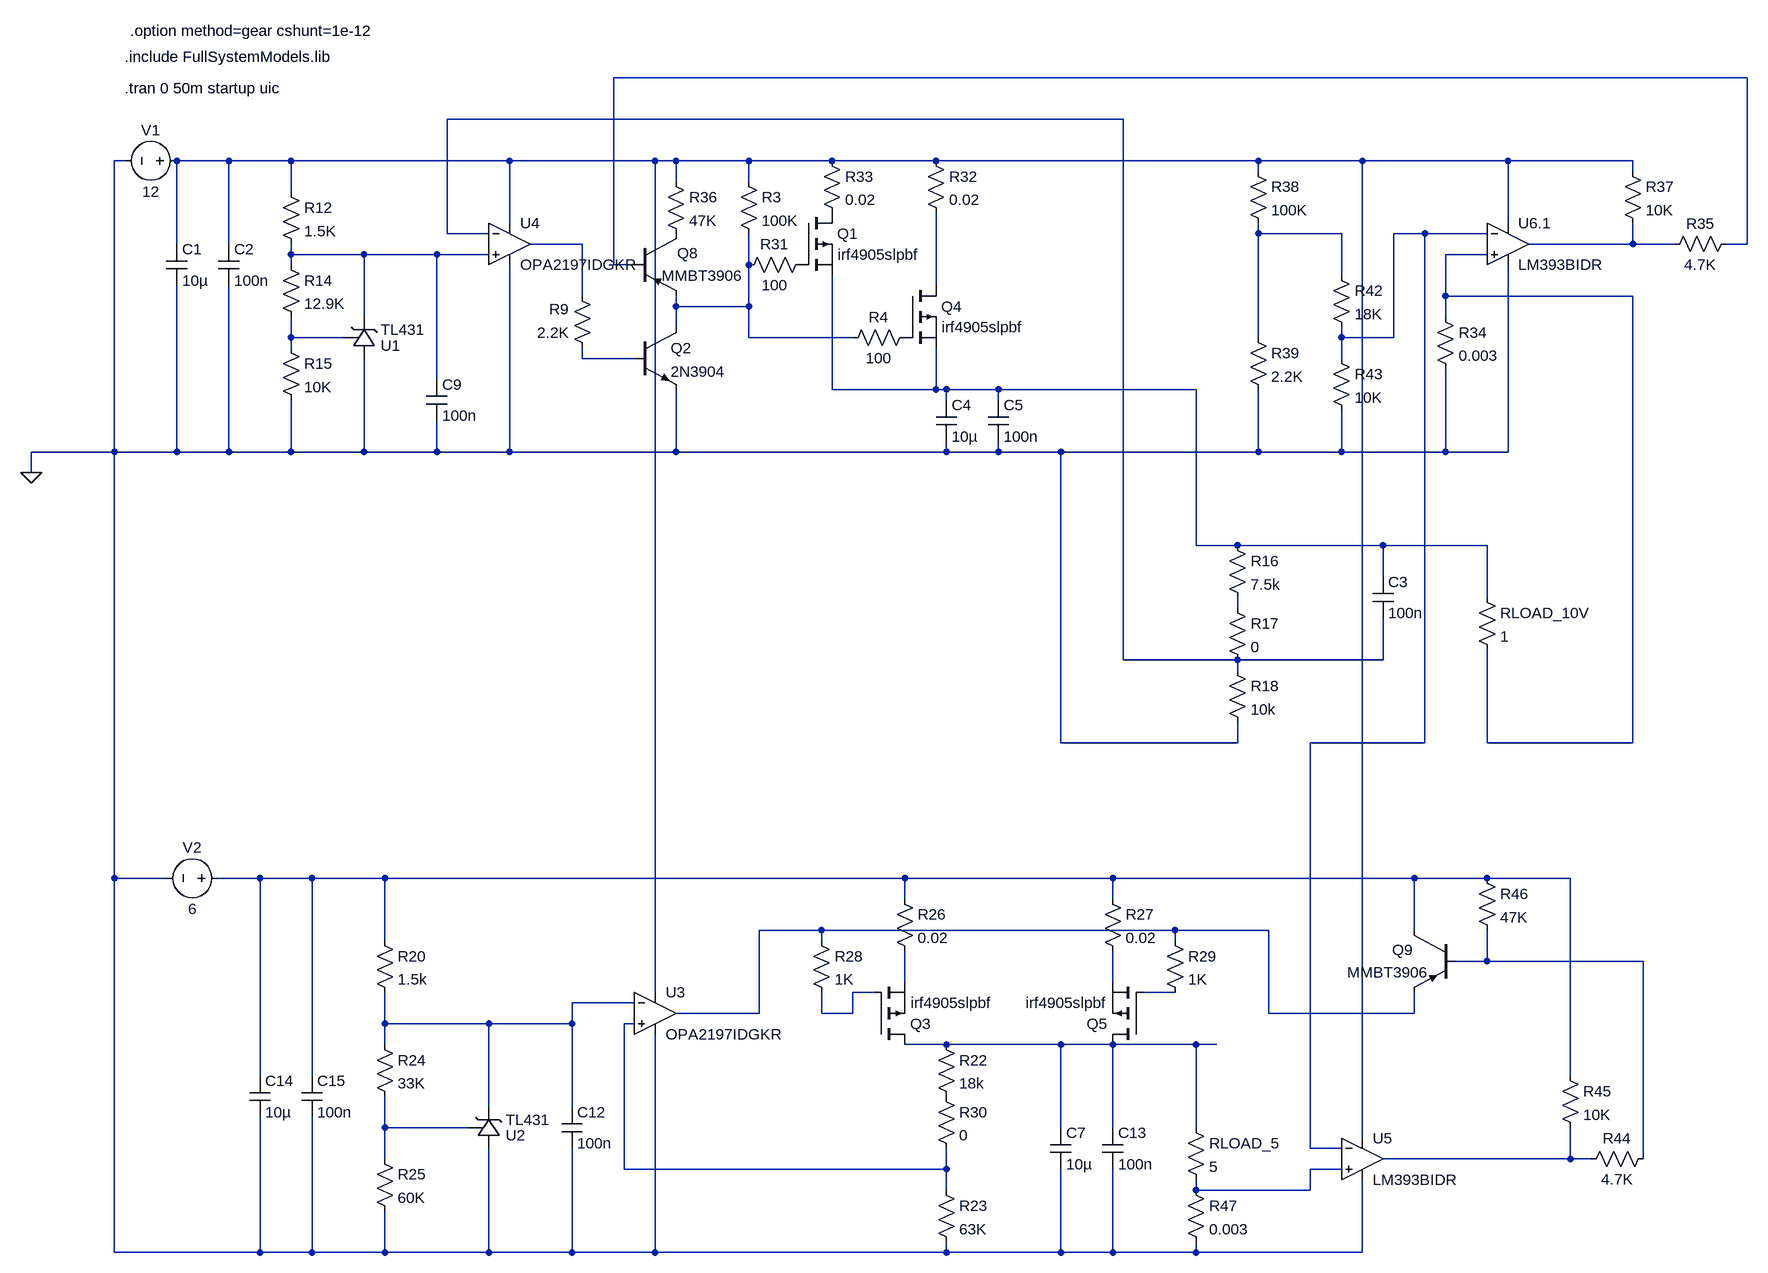
[diagram p0: schematic Draft2.asc]
Draft2.asc, the LTspice schematic file:
Version 4.1
SHEET 1 3060 1796
WIRE 2400 -32 656 -32
WIRE 1440 32 400 32
WIRE -96 96 -112 96
WIRE 64 96 -16 96
WIRE 160 96 64 96
WIRE 496 96 160 96
WIRE 720 96 496 96
WIRE 752 96 720 96
WIRE 864 96 752 96
WIRE 992 96 864 96
WIRE 1152 96 992 96
WIRE 1648 96 1152 96
WIRE 1808 96 1648 96
WIRE 2032 96 1808 96
WIRE 2224 96 2032 96
WIRE 1648 112 1648 96
WIRE 2224 112 2224 96
WIRE 752 128 752 96
WIRE 864 128 864 96
WIRE 160 144 160 96
WIRE 496 192 496 96
WIRE 2032 192 2032 96
WIRE 400 208 400 32
WIRE 464 208 400 208
WIRE 1648 208 1648 192
WIRE 1776 208 1648 208
WIRE 1904 208 1856 208
WIRE 2000 208 1904 208
WIRE -16 224 -16 96
WIRE 64 224 64 96
WIRE 608 224 528 224
WIRE 2224 224 2224 192
WIRE 2224 224 2064 224
WIRE 2288 224 2224 224
WIRE 2400 224 2400 -32
WIRE 2400 224 2368 224
WIRE 160 240 160 224
WIRE 272 240 160 240
WIRE 384 240 272 240
WIRE 464 240 384 240
WIRE 2000 240 1936 240
WIRE 160 256 160 240
WIRE 656 256 656 -32
WIRE 688 256 656 256
WIRE 864 256 864 208
WIRE 1776 272 1776 208
WIRE 1152 288 1152 176
WIRE 608 304 608 224
WIRE 1936 304 1936 240
WIRE 2224 304 1936 304
WIRE 752 320 752 304
WIRE 864 320 864 256
WIRE 864 320 752 320
WIRE 272 336 272 240
WIRE 1936 336 1936 304
WIRE 752 352 752 320
WIRE 160 368 160 336
WIRE 240 368 160 368
WIRE 864 368 864 320
WIRE 1024 368 864 368
WIRE 1648 368 1648 208
WIRE 1776 368 1776 352
WIRE 1856 368 1856 208
WIRE 1856 368 1776 368
WIRE 160 384 160 368
WIRE 608 400 608 384
WIRE 688 400 608 400
WIRE 1776 400 1776 368
WIRE 384 432 384 240
WIRE 992 448 992 272
WIRE 1152 448 1152 384
WIRE 1152 448 992 448
WIRE 1168 448 1152 448
WIRE 1248 448 1168 448
WIRE 1552 448 1248 448
WIRE 1168 464 1168 448
WIRE 1248 464 1248 448
WIRE -112 544 -112 96
WIRE -112 544 -240 544
WIRE -16 544 -16 288
WIRE -16 544 -112 544
WIRE 64 544 64 288
WIRE 64 544 -16 544
WIRE 160 544 160 464
WIRE 160 544 64 544
WIRE 272 544 272 400
WIRE 272 544 160 544
WIRE 384 544 384 496
WIRE 384 544 272 544
WIRE 496 544 496 256
WIRE 496 544 384 544
WIRE 752 544 752 448
WIRE 752 544 496 544
WIRE 1168 544 1168 528
WIRE 1168 544 752 544
WIRE 1248 544 1248 528
WIRE 1248 544 1168 544
WIRE 1344 544 1248 544
WIRE 1648 544 1648 448
WIRE 1648 544 1344 544
WIRE 1776 544 1776 480
WIRE 1776 544 1648 544
WIRE 1936 544 1936 416
WIRE 1936 544 1776 544
WIRE 2032 544 2032 256
WIRE 2032 544 1936 544
WIRE -240 576 -240 544
WIRE 1552 688 1552 448
WIRE 1616 688 1552 688
WIRE 1840 688 1616 688
WIRE 2000 688 1840 688
WIRE 1840 736 1840 688
WIRE 2000 768 2000 688
WIRE 1616 784 1616 768
WIRE 1440 864 1440 32
WIRE 1616 864 1440 864
WIRE 1840 864 1840 800
WIRE 1840 864 1616 864
WIRE 1616 880 1616 864
WIRE 1344 992 1344 544
WIRE 1616 992 1616 960
WIRE 1616 992 1344 992
WIRE 1904 992 1904 208
WIRE 1904 992 1728 992
WIRE 2000 992 2000 848
WIRE 2224 992 2224 304
WIRE 2224 992 2000 992
WIRE -112 1200 -112 544
WIRE -32 1200 -112 1200
WIRE 112 1200 48 1200
WIRE 192 1200 112 1200
WIRE 304 1200 192 1200
WIRE 1104 1200 304 1200
WIRE 1424 1200 1104 1200
WIRE 1888 1200 1424 1200
WIRE 2000 1200 1888 1200
WIRE 2128 1200 2000 1200
WIRE 1104 1232 1104 1200
WIRE 1424 1232 1424 1200
WIRE 976 1280 880 1280
WIRE 1520 1280 976 1280
WIRE 1664 1280 1520 1280
WIRE 1888 1280 1888 1200
WIRE 304 1296 304 1200
WIRE 976 1296 976 1280
WIRE 1520 1296 1520 1280
WIRE 2000 1328 2000 1280
WIRE 2000 1328 1952 1328
WIRE 2240 1328 2000 1328
WIRE 1104 1360 1104 1312
WIRE 1424 1360 1424 1312
WIRE 720 1376 720 96
WIRE 1056 1376 1024 1376
WIRE 1520 1376 1472 1376
WIRE 688 1392 592 1392
WIRE 880 1408 880 1280
WIRE 880 1408 752 1408
WIRE 976 1408 976 1376
WIRE 1024 1408 1024 1376
WIRE 1024 1408 976 1408
WIRE 1664 1408 1664 1280
WIRE 1888 1408 1888 1376
WIRE 1888 1408 1664 1408
WIRE 304 1424 304 1376
WIRE 464 1424 304 1424
WIRE 592 1424 592 1392
WIRE 592 1424 464 1424
WIRE 688 1424 672 1424
WIRE 304 1456 304 1424
WIRE 1168 1456 1104 1456
WIRE 1344 1456 1168 1456
WIRE 1424 1456 1344 1456
WIRE 1552 1456 1424 1456
WIRE 1584 1456 1552 1456
WIRE 112 1504 112 1200
WIRE 192 1504 192 1200
WIRE 2128 1504 2128 1200
WIRE 464 1552 464 1424
WIRE 592 1552 592 1424
WIRE 304 1584 304 1536
WIRE 432 1584 304 1584
WIRE 1344 1584 1344 1456
WIRE 1424 1584 1424 1456
WIRE 1552 1584 1552 1456
WIRE 1808 1600 1808 96
WIRE 1728 1616 1728 992
WIRE 1776 1616 1728 1616
WIRE 304 1632 304 1584
WIRE 2128 1632 2128 1584
WIRE 2128 1632 1840 1632
WIRE 2160 1632 2128 1632
WIRE 2240 1632 2240 1328
WIRE 672 1648 672 1424
WIRE 1168 1648 1168 1616
WIRE 1168 1648 672 1648
WIRE 1776 1648 1728 1648
WIRE 1168 1680 1168 1648
WIRE 1552 1680 1552 1664
WIRE 1728 1680 1728 1648
WIRE 1728 1680 1552 1680
WIRE -112 1776 -112 1200
WIRE 112 1776 112 1568
WIRE 112 1776 -112 1776
WIRE 192 1776 192 1568
WIRE 192 1776 112 1776
WIRE 304 1776 304 1712
WIRE 304 1776 192 1776
WIRE 464 1776 464 1616
WIRE 464 1776 304 1776
WIRE 592 1776 592 1616
WIRE 592 1776 464 1776
WIRE 720 1776 720 1440
WIRE 720 1776 592 1776
WIRE 1168 1776 1168 1760
WIRE 1168 1776 720 1776
WIRE 1344 1776 1344 1648
WIRE 1344 1776 1168 1776
WIRE 1424 1776 1424 1648
WIRE 1424 1776 1344 1776
WIRE 1552 1776 1552 1760
WIRE 1552 1776 1424 1776
WIRE 1808 1776 1808 1664
WIRE 1808 1776 1552 1776
FLAG -240 576 0
SYMBOL voltage 0 96 R90
WINDOW 0 -32 56 VBottom 2
WINDOW 3 32 56 VTop 2
SYMATTR InstName V1
SYMATTR Value 12
SYMBOL OpAmps\\opamp2 496 160 R0
SYMATTR InstName U4
SYMATTR Value OPA2197IDGKR
SYMBOL cap -32 224 R0
SYMATTR InstName C1
SYMATTR Value 10µ
SYMBOL cap 48 224 R0
SYMATTR InstName C2
SYMATTR Value 100n
SYMBOL res 1600 864 R0
SYMATTR InstName R18
SYMATTR Value 10k
SYMBOL res 1600 768 R0
SYMATTR InstName R17
SYMATTR Value 0
SYMBOL res 1600 672 R0
SYMATTR InstName R16
SYMATTR Value 7.5k
SYMBOL cap 1824 736 R0
SYMATTR InstName C3
SYMATTR Value 100n
SYMBOL res 144 128 R0
SYMATTR InstName R12
SYMATTR Value 1.5K
SYMBOL res 144 240 R0
SYMATTR InstName R14
SYMATTR Value 12.9K
SYMBOL res 144 368 R0
SYMATTR InstName R15
SYMATTR Value 10K
SYMBOL cap 368 432 R0
SYMATTR InstName C9
SYMATTR Value 100n
SYMBOL res 624 400 R180
WINDOW 0 36 76 Left 2
WINDOW 3 36 40 Left 2
SYMATTR InstName R9
SYMATTR Value 2.2K
SYMBOL npn 688 352 R0
SYMATTR InstName Q2
SYMATTR Value 2N3904
SYMBOL pnp 688 208 R0
WINDOW 0 66 30 Left 2
WINDOW 3 42 65 Left 2
SYMATTR InstName Q8
SYMATTR Value MMBT3906
SYMBOL res 736 112 R0
SYMATTR InstName R36
SYMATTR Value 47K
SYMBOL pmos 944 176 R0
WINDOW 3 57 64 Left 2
SYMATTR Value irf4905slpbf
SYMATTR InstName Q1
SYMBOL pmos 1104 288 R0
WINDOW 3 57 64 Left 2
SYMATTR Value irf4905slpbf
SYMATTR InstName Q4
SYMBOL res 976 80 R0
SYMATTR InstName R33
SYMATTR Value 0.02
SYMBOL res 1136 80 R0
SYMATTR InstName R32
SYMATTR Value 0.02
SYMBOL res 960 240 R90
WINDOW 0 0 56 VBottom 2
WINDOW 3 32 56 VTop 2
SYMATTR InstName R31
SYMATTR Value 100
SYMBOL res 1120 352 R90
WINDOW 0 0 56 VBottom 2
WINDOW 3 32 56 VTop 2
SYMATTR InstName R4
SYMATTR Value 100
SYMBOL res 848 112 R0
SYMATTR InstName R3
SYMATTR Value 100K
SYMBOL cap 1152 464 R0
SYMATTR InstName C4
SYMATTR Value 10µ
SYMBOL cap 1232 464 R0
SYMATTR InstName C5
SYMATTR Value 100n
SYMBOL res 1984 752 R0
SYMATTR InstName RLOAD_10V
SYMATTR Value 1
SYMBOL OpAmps\\opamp2 2032 160 R0
SYMATTR InstName U6.1
SYMATTR Value LM393BIDR
SYMBOL res 1632 352 R0
SYMATTR InstName R39
SYMATTR Value 2.2K
SYMBOL res 1760 256 R0
SYMATTR InstName R42
SYMATTR Value 18K
SYMBOL res 1760 384 R0
SYMATTR InstName R43
SYMATTR Value 10K
SYMBOL res 1920 320 R0
SYMATTR InstName R34
SYMATTR Value 0.003
SYMBOL res 2208 96 R0
SYMATTR InstName R37
SYMATTR Value 10K
SYMBOL res 1632 96 R0
SYMATTR InstName R38
SYMATTR Value 100K
SYMBOL res 2384 208 R90
WINDOW 0 0 56 VBottom 2
WINDOW 3 32 56 VTop 2
SYMATTR InstName R35
SYMATTR Value 4.7K
SYMBOL _TL431\\TL431\\TL431 256 400 M180
SYMATTR InstName U1
SYMBOL voltage 64 1200 R90
WINDOW 0 -32 56 VBottom 2
WINDOW 3 32 56 VTop 2
SYMATTR InstName V2
SYMATTR Value 6
SYMBOL cap 96 1504 R0
SYMATTR InstName C14
SYMATTR Value 10µ
SYMBOL cap 176 1504 R0
SYMATTR InstName C15
SYMATTR Value 100n
SYMBOL res 288 1280 R0
SYMATTR InstName R20
SYMATTR Value 1.5k
SYMBOL res 288 1440 R0
SYMATTR InstName R24
SYMATTR Value 33K
SYMBOL res 288 1616 R0
SYMATTR InstName R25
SYMATTR Value 60K
SYMBOL _TL431\\TL431\\TL431 448 1616 M180
SYMATTR InstName U2
SYMBOL OpAmps\\opamp2 720 1344 R0
SYMATTR InstName U3
SYMATTR Value OPA2197IDGKR
SYMBOL cap 576 1552 R0
SYMATTR InstName C12
SYMATTR Value 100n
SYMBOL res 1152 1440 R0
SYMATTR InstName R22
SYMATTR Value 18k
SYMBOL res 1152 1520 R0
SYMATTR InstName R30
SYMATTR Value 0
SYMBOL res 1152 1664 R0
SYMATTR InstName R23
SYMATTR Value 63K
SYMBOL res 960 1280 R0
SYMATTR InstName R28
SYMATTR Value 1K
SYMBOL res 1504 1280 R0
SYMATTR InstName R29
SYMATTR Value 1K
SYMBOL res 1088 1216 R0
SYMATTR InstName R26
SYMATTR Value 0.02
SYMBOL res 1408 1216 R0
SYMATTR InstName R27
SYMATTR Value 0.02
SYMBOL res 1536 1568 R0
SYMATTR InstName RLOAD_5
SYMATTR Value 5
SYMBOL pmos 1056 1456 M180
WINDOW 3 57 64 Left 2
SYMATTR Value irf4905slpbf
SYMATTR InstName Q3
SYMBOL pmos 1472 1456 R180
WINDOW 3 57 64 Left 2
SYMATTR Value irf4905slpbf
SYMATTR InstName Q5
SYMBOL cap 1408 1584 R0
SYMATTR InstName C13
SYMATTR Value 100n
SYMBOL cap 1328 1584 R0
SYMATTR InstName C7
SYMATTR Value 10µ
SYMBOL OpAmps\\opamp2 1808 1568 R0
SYMATTR InstName U5
SYMATTR Value LM393BIDR
SYMBOL pnp 1952 1280 M0
WINDOW 0 66 30 Left 2
WINDOW 3 42 65 Left 2
SYMATTR InstName Q9
SYMATTR Value MMBT3906
SYMBOL res 1984 1184 R0
SYMATTR InstName R46
SYMATTR Value 47K
SYMBOL res 2112 1488 R0
SYMATTR InstName R45
SYMATTR Value 10K
SYMBOL res 2256 1616 R90
WINDOW 0 0 56 VBottom 2
WINDOW 3 32 56 VTop 2
SYMATTR InstName R44
SYMATTR Value 4.7K
SYMBOL res 1536 1664 R0
SYMATTR InstName R47
SYMATTR Value 0.003
TEXT -96 -64 Left 2 !.include FullSystemModels.lib
TEXT -96 -16 Left 2 !.tran 0 50m startup uic
TEXT -88 -104 Left 2 !.option method=gear cshunt=1e-12

The netlist it stands for:
* Draft2.asc
V1 N003 0 12
X§U4 N008 N002 N003 0 N006 OPA2197IDGKR  ; pins In+ In- V+ V- OUT
C1 N003 0 10µ
C2 N003 0 100n
R18 N002 0 10k
R17 N015 N002 0
R16 N014 N015 7.5k
C3 N014 N002 100n
R12 N003 N008 1.5K
R14 N008 N012 12.9K
R15 N012 0 10K
C9 N008 0 100n
R9 N013 N006 2.2K
Q2 N010 N013 0 0 2N3904
Q8 P001 N001 N010 0 MMBT3906
R36 N003 P001 47K
M§Q1 P002 P003 N014 N014 irf4905slpbf
M§Q4 N011 P004 N014 N014 irf4905slpbf
R33 N003 P002 0.02
R32 N003 N011 0.02
R31 P003 N010 100
R4 P004 N010 100
R3 N003 N010 100K
C4 N014 0 10µ
C5 N014 0 100n
RLOAD_10V N014 N009 1
X§U6.1 N009 N005 N003 0 N007 LM393BIDR  ; pins In+ In- V+ V- OUT
R39 N004 0 2.2K
R42 N004 N005 18K
R43 N005 0 10K
R34 N009 0 0.003
R37 N003 N007 10K
R38 N003 N004 100K
R35 N001 N007 4.7K
X§U1 0 N008 N012 TL431 TL431  ; pins A K ref
V2 N016 0 6
C14 N016 0 10µ
C15 N016 0 100n
R20 N016 N023 1.5k
R24 N023 N026 33K
R25 N026 0 60K
X§U2 0 N023 N026 TL431 TL431  ; pins A K ref
X§U3 N024 N023 N003 0 N017 OPA2197IDGKR  ; pins In+ In- V+ V- OUT
C12 N023 0 100n
R22 N025 P005 18k
R30 P005 N024 0
R23 N024 0 63K
R28 N017 N021 1K
R29 N017 N022 1K
R26 N016 N019 0.02
R27 N016 N020 0.02
RLOAD_5 N025 N028 5
M§Q3 N025 N021 N019 N019 irf4905slpbf
M§Q5 N025 N022 N020 N020 irf4905slpbf
C13 N025 0 100n
C7 N025 0 10µ
X§U5 N028 N005 N003 0 N027 LM393BIDR  ; pins In+ In- V+ V- OUT
Q9 N016 N018 N017 0 MMBT3906
R46 N016 N018 47K
R45 N016 N027 10K
R44 N018 N027 4.7K
R47 N028 0 0.003
.model NPN NPN
.model PNP PNP
.lib standard.bjt
.model NMOS NMOS
.model PMOS PMOS
.lib standard.mos
.include FullSystemModels.lib
.tran 0 50m startup uic
.option method=gear cshunt=1e-12
.backanno
.end